# Altium schematic sheet MODULIQ_TDC.SchDoc: TDC
size A3; Author: M.Beldyga; CompanyName: WUT ISE; DrawnBy: M.Beldyga; Organization: WUT ISE; Address1: PW ISE; Address2: Nowowiejska 15/19 00-665 Warsaw; Address3: micbeldyga@gmail.com; SheetNumber: 1; SheetTotal: 2; ModifiedBy: -; CheckedDate: -; Title2: MODULIQ; DivGrp: WUT ISE; Designer: M.Beldyga; ModifiedDate: -; ProjectName: Sensor Box
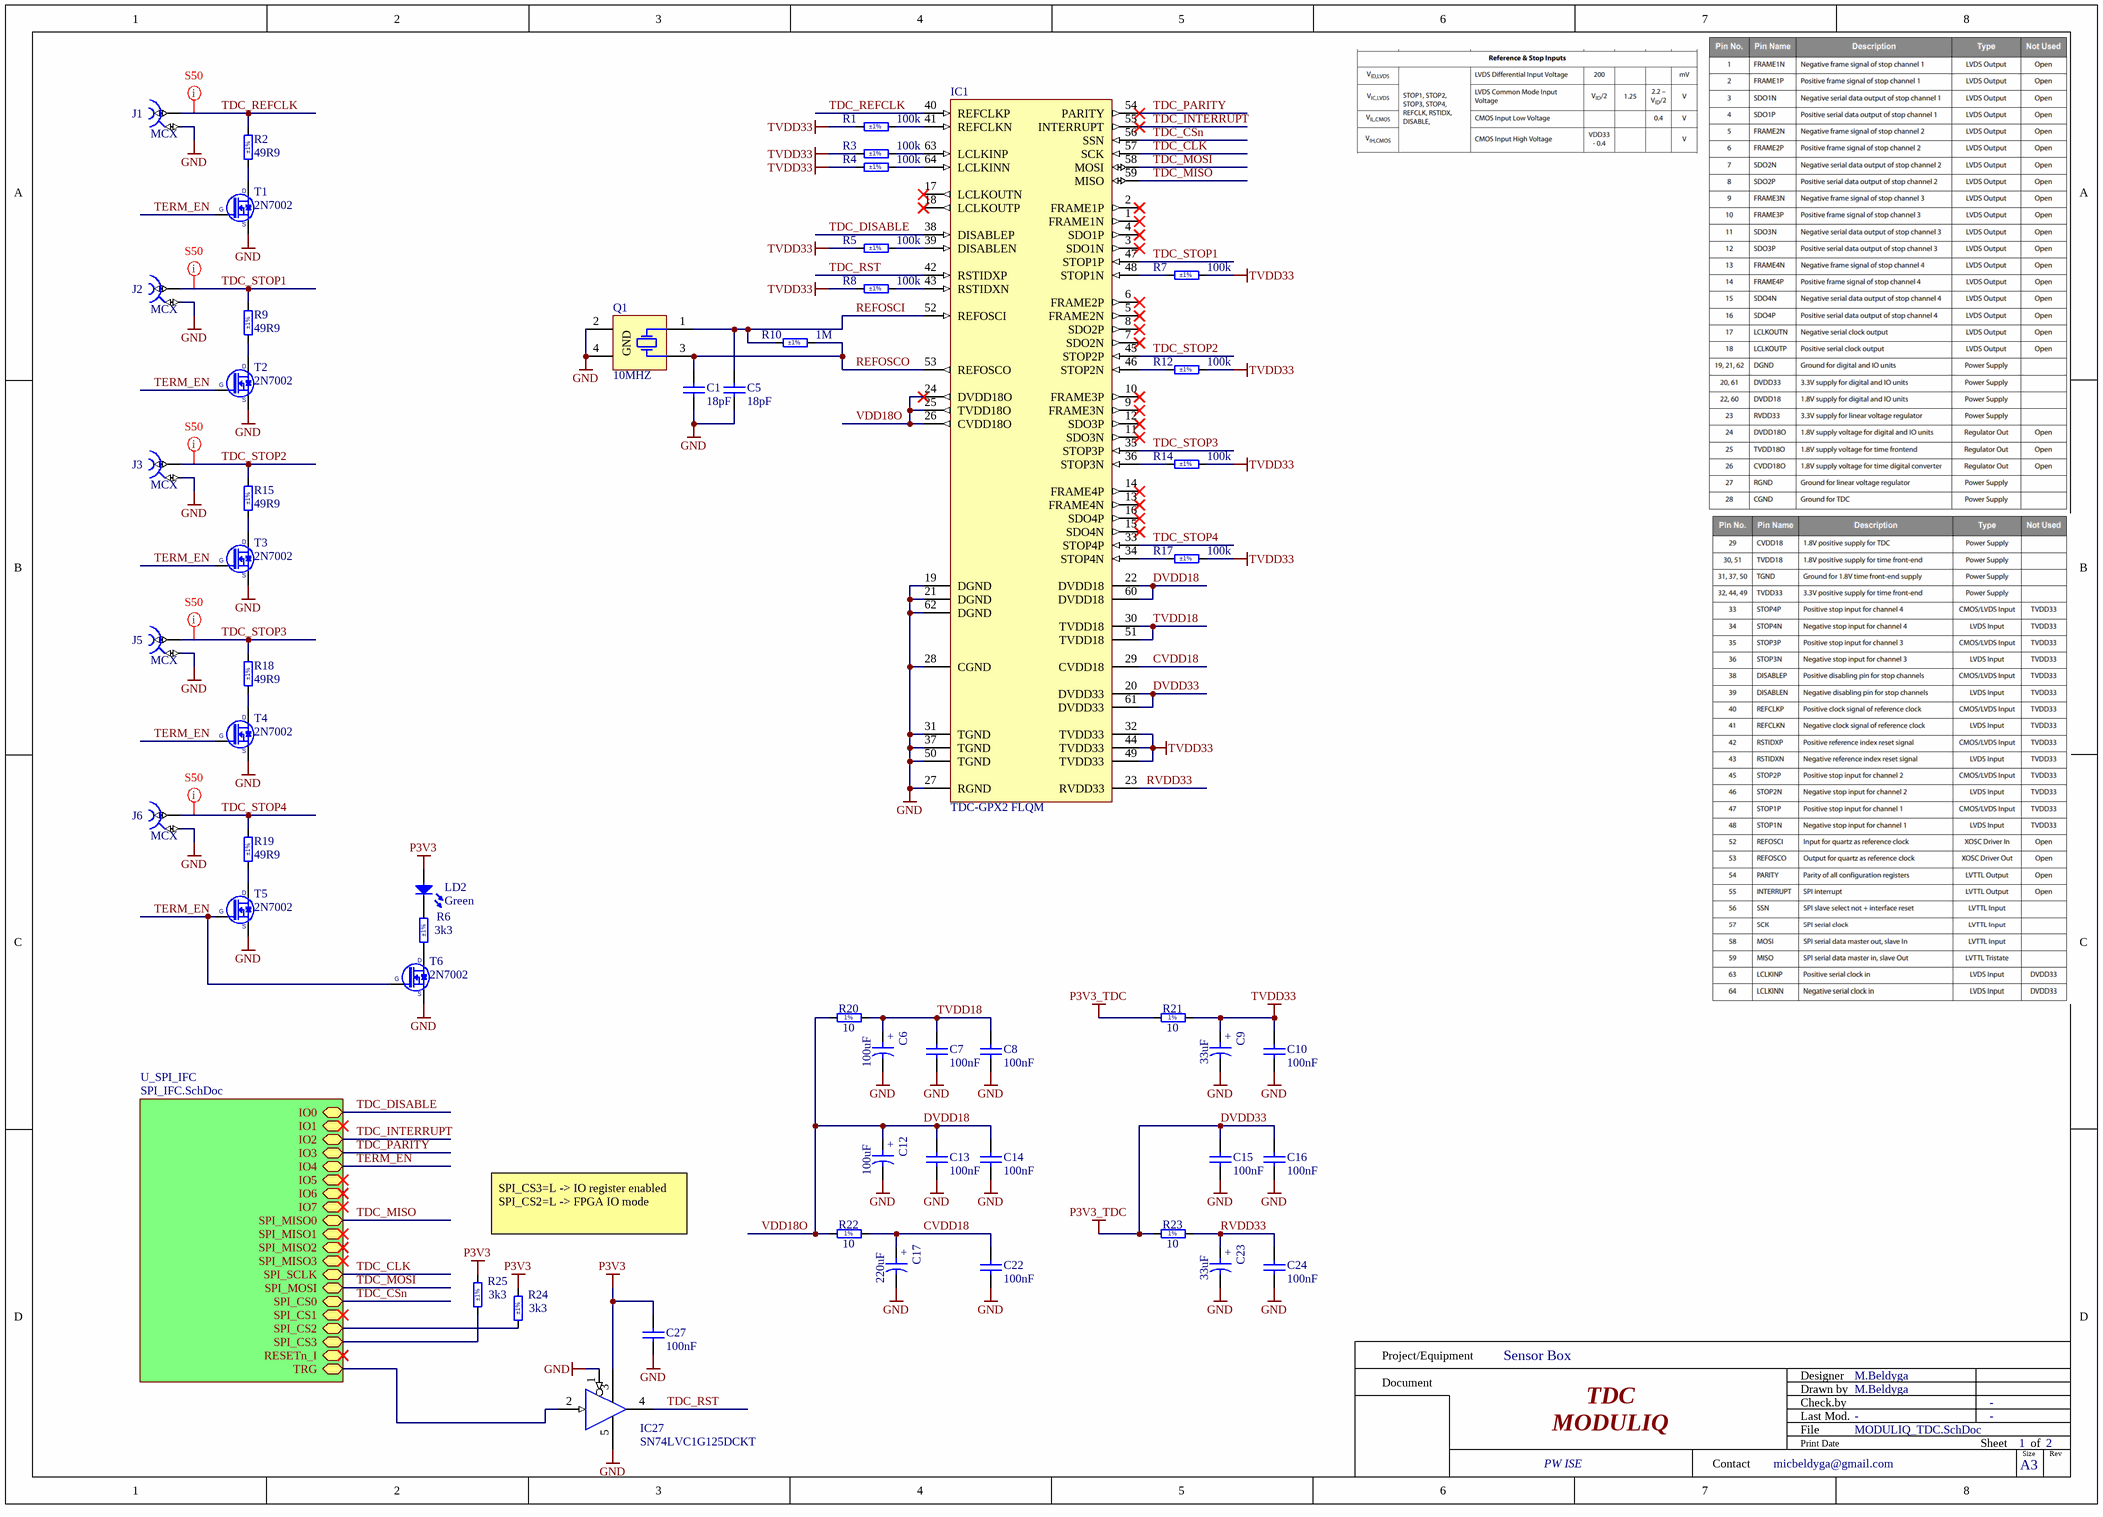
[diagram p0: MODULIQ_TDC.SchDoc]

## Parts
C1  18pF  [CAPC1005X55N]
C5  18pF  [CAPC1005X55N]
C6  100uF  [CAPMP3216X180N]
C7  100nF  [CAPC1005X55N]
C8  100nF  [CAPC1005X55N]
C9  33uF  [CAPMP3216X180N]
C10  100nF  [CAPC1005X55N]
C12  100uF  [CAPMP3216X180N]
C13  100nF  [CAPC1005X55N]
C14  100nF  [CAPC1005X55N]
C15  100nF  [CAPC1005X55N]
C16  100nF  [CAPC1005X55N]
C17  220uF  [CAPMP3528X210N]
C22  100nF  [CAPC1005X55N]
C23  33uF  [CAPMP3216X180N]
C24  100nF  [CAPC1005X55N]
C27  100nF  [CAPC1005X55N]
IC1  TDC-GPX2 FLQM  [QFP50P1200X1200X160-64N]
IC27  SN74LVC1G125DCKT  [SOT65P210X110-5N]
J1  MCX  [AMPHENOL_919-109J-51PX]
J2  MCX  [AMPHENOL_919-109J-51PX]
J3  MCX  [AMPHENOL_919-109J-51PX]
J5  MCX  [AMPHENOL_919-109J-51PX]
J6  MCX  [AMPHENOL_919-109J-51PX]
LD2  Green  [LED_KINGBRIGHT_KP-1608CGCK]
Q1  10MHZ  [XTAL_ABRACON_ABMM2]
R1  100k  Tolerance: ±1%  [RESC1005X40N]
R2  49R9  Tolerance: ±1%  [RESC3225X70N]
R3  100k  Tolerance: ±1%  [RESC1005X40N]
R4  100k  Tolerance: ±1%  [RESC1005X40N]
R5  100k  Tolerance: ±1%  [RESC1005X40N]
R6  3k3  Tolerance: ±1%  [RESC1005X40N]
R7  100k  Tolerance: ±1%  [RESC1005X40N]
R8  100k  Tolerance: ±1%  [RESC1005X40N]
R9  49R9  Tolerance: ±1%  [RESC3225X70N]
R10  1M  Tolerance: ±1%  [RESC1005X40N]
R12  100k  Tolerance: ±1%  [RESC1005X40N]
R14  100k  Tolerance: ±1%  [RESC1005X40N]
R15  49R9  Tolerance: ±1%  [RESC3225X70N]
R17  100k  Tolerance: ±1%  [RESC1005X40N]
R18  49R9  Tolerance: ±1%  [RESC3225X70N]
R19  49R9  Tolerance: ±1%  [RESC3225X70N]
R20  10  [RESC1005X40N]
R21  10  [RESC1005X40N]
R22  10  [RESC1005X40N]
R23  10  [RESC1005X40N]
R24  3k3  Tolerance: ±1%  [RESC1005X40N]
R25  3k3  Tolerance: ±1%  [RESC1005X40N]
T1  2N7002  [SOT95P240X130-3N]
T2  2N7002  [SOT95P240X130-3N]
T3  2N7002  [SOT95P240X130-3N]
T4  2N7002  [SOT95P240X130-3N]
T5  2N7002  [SOT95P240X130-3N]
T6  2N7002  [SOT95P240X130-3N]

## Sub-sheets
U_SPI_IFC = SPI_IFC.SchDoc: IO0 (bidir), IO1 (bidir), IO2 (bidir), IO3 (bidir), IO4 (bidir), IO5 (bidir), IO6 (bidir), IO7 (bidir), SPI_MISO0 (bidir), SPI_MISO1 (bidir), SPI_MISO2 (bidir), SPI_MISO3 (bidir), SPI_SCLK (bidir), SPI_MOSI (bidir), SPI_CS0 (bidir), SPI_CS1 (bidir), SPI_CS2 (bidir), SPI_CS3 (bidir), RESETn_I (bidir), TRG (bidir)

## Nets
DVDD33: C15.2 C16.2 IC1.20(DVDD33) IC1.61(DVDD33) R21.1 R23.1  [also labelled P3V3_TDC]
GND: C1.1 C5.1 C6.2 C7.1 C8.1 C9.2 C10.1 C12.2 C13.1 C14.1 C15.1 C16.1 C17.2 C22.1 C23.2 C24.1 C27.1 IC1.19(DGND) IC1.21(DGND) IC1.27(RGND) IC1.28(CGND) IC1.31(TGND) IC1.37(TGND) IC1.50(TGND) IC1.62(DGND) IC27.1(~{G}) IC27.5(VCC) J1.2 J2.2 J3.2 J5.2 J6.2 Q1.2(GND) Q1.4(GND) T1.2(S) T2.2(S) T3.2(S) T4.2(S) T5.2(S) T6.2(S)
P3V3: C27.2 IC27.3(GND) LD2.2(A) R24.1 R25.1
TVDD33: C9.1 C10.2 IC1.32(TVDD33) IC1.44(TVDD33) IC1.49(TVDD33) R1.2 R3.2 R4.2 R5.2 R7.2 R8.2 R12.2 R14.2 R17.2 R21.2
CVDD18: C17.1 C22.2 IC1.29(CVDD18) R22.2
DVDD18: C12.1 C13.2 C14.2 IC1.22(DVDD18) IC1.24(DVDD18O) IC1.25(TVDD18O) IC1.26(CVDD18O) IC1.60(DVDD18) R20.1 R22.1  [also labelled VDD18O]
REFOSCI: C5.2 IC1.52(REFOSCI) Q1.1(X) R10.2
REFOSCO: C1.2 IC1.53(REFOSCO) Q1.3(X) R10.1
RVDD33: C23.1 C24.2 IC1.23(RVDD33) R23.2
TDC_CLK: IC1.57(SCK) ; sheet U_SPI_IFC/SPI_SCLK
TDC_CSn: IC1.56(SSN) ; sheet U_SPI_IFC/SPI_CS0
TDC_DISABLE: IC1.38(DISABLEP) ; sheet U_SPI_IFC/IO0
TDC_INTERRUPT: IC1.55(INTERRUPT) ; sheet U_SPI_IFC/IO2
TDC_MISO: IC1.59(MISO) ; sheet U_SPI_IFC/SPI_MISO0
TDC_MOSI: IC1.58(MOSI) ; sheet U_SPI_IFC/SPI_MOSI
TDC_PARITY: IC1.54(PARITY) ; sheet U_SPI_IFC/IO3
TDC_REFCLK: IC1.40(REFCLKP) J1.1 R2.2
TDC_RST: IC1.42(RSTIDXP) IC27.4(OUT)
TDC_STOP1: IC1.47(STOP1P) J2.1 R9.2
TDC_STOP2: IC1.45(STOP2P) J3.1 R15.2
TDC_STOP3: IC1.35(STOP3P) J5.1 R18.2
TDC_STOP4: IC1.33(STOP4P) J6.1 R19.2
TERM_EN: T1.1(G) T2.1(G) T3.1(G) T4.1(G) T5.1(G) T6.1(G) ; sheet U_SPI_IFC/IO4
TVDD18: C6.1 C7.2 C8.2 IC1.30(TVDD18) IC1.51(TVDD18) R20.2
NetIC1_34: IC1.34(STOP4N) R17.1
NetIC1_36: IC1.36(STOP3N) R14.1
NetIC1_39: IC1.39(DISABLEN) R5.1
NetIC1_41: IC1.41(REFCLKN) R1.1
NetIC1_43: IC1.43(RSTIDXN) R8.1
NetIC1_46: IC1.46(STOP2N) R12.1
NetIC1_48: IC1.48(STOP1N) R7.1
NetIC1_63: IC1.63(LCLKINP) R3.1
NetIC1_64: IC1.64(LCLKINN) R4.1
NetIC27_2: IC27.2(IN) ; sheet U_SPI_IFC/TRG
NetLD2_1: LD2.1(C) R6.1
NetR2_1: R2.1 T1.3(D)
NetR6_2: R6.2 T6.3(D)
NetR9_1: R9.1 T2.3(D)
NetR15_1: R15.1 T3.3(D)
NetR18_1: R18.1 T4.3(D)
NetR19_1: R19.1 T5.3(D)
NetR24_2: R24.2 ; sheet U_SPI_IFC/SPI_CS2
NetR25_2: R25.2 ; sheet U_SPI_IFC/SPI_CS3

Not connected (* = marked no-connect by the designer): IC1 1(FRAME1N)* 2(FRAME1P)* 3(SDO1N)* 4(SDO1P)* 5(FRAME2N)* 6(FRAME2P)* 7(SDO2N)* 8(SDO2P)* 9(FRAME3N)* 10(FRAME3P)* 11(SDO3N)* 12(SDO3P)* 13(FRAME4N)* 14(FRAME4P)* 15(SDO4N)* 16(SDO4P)* 17(LCLKOUTN)* 18(LCLKOUTP)*

## Layout directives
net class S50: TDC_REFCLK
net class S50; net class TDC_IN: TDC_STOP1, TDC_STOP2, TDC_STOP3, TDC_STOP4

## Notes on the sheet
- SPI_CS3=L -> IO register enabled
  SPI_CS2=L -> FPGA IO mode
- Project/Equipment
- Document
- Designer
- Drawn by
- Check.by
- Contact
- File
- Last Mod.
- Print Date
- Sheet
- Size
- A3
- of
- Rev
- (in symbol CTE3216-18_33UF_4V_10%) +
- (in symbol CTE3216-18_100UF_6.3V_20%_ESR0500_AVX_TLJ) +
- (in symbol CTE3528-21_220UF_2.5V_10%) +
- (in symbol R0402_10R_1%_0.0625W_200PPM) 1%

## Library data of the parts
C1 C5 = CC0402_18PF_50V_5%_C0G: Non-polarised capacitor; Part Description: SMD Multilayer Chip Ceramic Capacitor; Manufacturer: GENERIC; Manufacturer1 Part Number: C0402C180J5GACTU; Voltage: 50V; TC: C0G/NP0; Tolerance: ±5%; Part Number: CC0402_18PF_50V_5%_C0G; Component Kind: Standard; Component Type: Standard; Pin Count: 2; Value: 18pF; Status: Preferred; Manufacturer Part Number: CC0402_18PF_50V_5%_C0G; Case: 0402; Mounted: Yes; Socket: No; SMD: Yes; Sense: No; Manufacturer1 Example: KEMET; Manufacturer1 ComponentHeight: 0.55mm; HelpURL: \\cern.ch\dfs\Applications\Altium\Datasheets\CC0402_C0G_KEMET_(Commercial Grade).pdf; Author: CERN DEM JLC; CreateDate: 10/4/2016; LatestRevisionDate: 10/4/2016
C6 C12 = CTE3216-18_100UF_6.3V_20%_ESR0500_AVX_TLJ: Polarised capacitor; Part Description: ESR 0R5 Solid Tantalum Chip Capacitor; Manufacturer: AVX; Manufacturer Part Number: TLJA107M006R0500; Voltage: 6.3V; Tolerance: ±20%; Part Number: CTE3216-18_100UF_6.3V_20%_ESR0500_AVX_TLJ; Component Kind: Standard; Component Type: Standard; Pin Count: 2; Value: 100uF; Status: None; Case: A; Mounted: Yes; Socket: No; SMD: Yes; Sense: No; ComponentHeight: 1.8mm; HelpURL: \\cern.ch\dfs\Applications\Altium\Datasheets\CTE_AVX_TLJ.pdf; Author: CERN DEM JLC; CreateDate: 19.12.2013; LatestRevisionDate: 19.12.2013
C7 C8 C10 C13-C16 C22 C24 C27 = CC0402_100NF_50V_10%_X7R: Non-polarised capacitor; Part Description: SMD Multilayer Chip Ceramic Capacitor; Manufacturer: GENERIC; Manufacturer1 Part Number: GRM155R71H104KE14D; Voltage: 50V; TC: X7R; Tolerance: ±10%; Part Number: CC0402_100NF_50V_10%_X7R; Component Kind: Standard; Component Type: Standard; Pin Count: 2; Value: 100nF; Status: None; Manufacturer Part Number: CC0402_100NF_50V_10%_X7R; Case: 0402; Mounted: Yes; Socket: No; SMD: Yes; Sense: No; Manufacturer1 Example: MURATA; Manufacturer1 ComponentHeight: 0.55mm; HelpURL: \\cern.ch\dfs\Applications\Altium\Datasheets\CC0402_MURATA_GRM155R71H104KE14D.pdf; Author: CERN DEM MR; CreateDate: 6/30/2017; LatestRevisionDate: 6/30/2017
C9 C23 = CTE3216-18_33UF_4V_10%: Polarised capacitor; Part Description: Solid Tantalum Chip Capacitor; Manufacturer: GENERIC; Manufacturer1 Part Number: TAJA336K004R; Voltage: 4V; Tolerance: ±10%; Part Number: CTE3216-18_33UF_4V_10%; Component Kind: Standard; Component Type: Standard; Pin Count: 2; Value: 33uF; Status: Preferred; Manufacturer Part Number: CTE3216-18_33UF_4V_10%; Case: A; Mounted: Yes; Socket: No; SMD: Yes; Sense: No; Manufacturer1 Example: AVX; Manufacturer1 ComponentHeight: 1.8mm; HelpURL: \\cern.ch\dfs\Applications\Altium\Datasheets\CTE_AVX_TAJ.pdf; Author: CERN DEM JLC; CreateDate: 03.12.2007; LatestRevisionDate: 03.12.2007
C17 = CTE3528-21_220UF_2.5V_10%: Polarised capacitor; Part Description: Solid Tantalum Chip Capacitor; Manufacturer: GENERIC; Manufacturer1 Part Number: TAJB227K002R; Voltage: 2.5V; Tolerance: ±10%; Part Number: CTE3528-21_220UF_2.5V_10%; Component Kind: Standard; Component Type: Standard; Pin Count: 2; Value: 220uF; Status: Preferred; Manufacturer Part Number: CTE3528-21_220UF_2.5V_10%; Case: B; Mounted: Yes; Socket: No; SMD: Yes; Sense: No; Manufacturer1 Example: AVX; Manufacturer1 ComponentHeight: 2.1mm; HelpURL: \\cern.ch\dfs\Applications\Altium\Datasheets\CTE_AVX_TAJ.pdf; Author: CERN DEM JLC; CreateDate: 03.12.2007; LatestRevisionDate: 03.12.2007
IC1 = TDC-GPX2: 4 Channel Time to Digital Converter; Manufacturer: AMS; PressFit: No; Bonding: No; Part Number: TDC-GPX2; Component Kind: Standard; Component Type: Standard; Device: TDC-GPX2 FLQM; PackageDescription: QFP, 0.50mm Pitch, Square; 64 Pin, 10.0mm L X 10.0mm W X 1.60mm H Body, IPC Medium Density; Part Description: 4 Channel Time to Digital Converter; Manufacturer Part Number: TDC-GPX2 FLQM; Pin Count: 64; Case: QFP64; Mounted: Yes; Socket: No; SMD: Yes; Sense: No; ComponentHeight: 1.6mm; Author: CERN DEM MR; HelpURL: \\cern.ch\dfs\Applications\Altium\Datasheets\AMS_TDC-GPX2.pdf; CreateDate: 4/23/2019; LatestRevisionDate: 4/5/2024
IC27 = SN74LVC1G125DCKT: Single Bus Buffer Gate With 3-State Output; Part Description: Single Bus Buffer Gate With 3-State Outputs; Manufacturer: TEXAS INSTRUMENTS; PressFit: No; Bonding: No; Part Number: SN74LVC1G125DCKT; Component Kind: Standard; Component Type: Standard; Device: SN74LVC1G125DCKT; PackageDescription: SOT353, SC70-5, SOT, 0.65mm Pitch, 5 pin, 1.25mm W X 2.00mm L X 1.10mm H, IPC Medium Density; Manufacturer Part Number: SN74LVC1G125DCKT; Pin Count: 5; Case: SOT353; Mounted: Yes; Socket: No; SMD: Yes; Sense: No; ComponentHeight: 1.1mm; Author: CERN DEM JLC; HelpURL: \\cern.ch\dfs\Applications\Altium\Datasheets\SN74LVC1G125DCKT.pdf; CreateDate: 12/19/2011; LatestRevisionDate: 12/19/2011
J1-J3 J5 J6 = AMPHENOL_919-109J-51PX: Part Description: 50 Ohms, RF Connector, MCX Straight PCB Receptacle Jack; Manufacturer Part Number: 919-109J-51PX (MCX6251B1-3GT30G-50); PressFit: No; Part Number: AMPHENOL_919-109J-51PX; Component Kind: Standard; Component Type: Standard; Pin Count: 5; Family: MCX; Mounted: Yes; Socket: No; SMD: No; Sense: No; Status: None; Manufacturer: AMPHENOL; ComponentHeight: 6.06mm; HelpURL: \\cern.ch\dfs\Applications\Altium\Datasheets\AMPHENOL_919-109J-51PX.pdf; Author: CERN DEM BC; CreateDate: 31.01.2019; LatestRevisionDate: 31.01.2019
LD2 = LED_KINGBRIGHT_KP-1608CGCK: LED Green 1C 2A; Part Description: 1.6x0.8mm SMD Chip Green LED Lamp; PressFit: No; Bonding: No; Part Number: LED_KINGBRIGHT_KP-1608CGCK; Component Kind: Standard; Component Type: Standard; Color: Green; PackageDescription: SMT Green LED, Case 0603, Body L 1.60mm x W 0.80mm x H 1.10mm; Manufacturer: KINGBRIGHT; Manufacturer Part Number: KP-1608CGCK; Pin Count: 2; Case: 0603; Mounted: Yes; Socket: No; SMD: Yes; Sense: No; ComponentHeight: 1.1mm; HelpURL: \\cern.ch\dfs\Applications\Altium\Datasheets\LED_KINGBRIGHT_KP-1608CGCK.pdf; Author: CERN DEM HF; CreateDate: 10/1/2021; LatestRevisionDate: 10/1/2021
Q1 = XTAL_10MHZ_ABRACON_ABMM2-10.000MHZ-E2-T: Crystal 4 pins 1=XTAL Control 2=GND3=XTAL 4=GND; Part Description: Tolerance: ±20ppm, -20°C to +70°C, 18pF, SMD Crystal, ABMM2 Series; PressFit: No; Bonding: No; Part Number: XTAL_10MHZ_ABRACON_ABMM2-10.000MHZ-E2-T; Component Kind: Standard; Component Type: Standard; PackageDescription: 4 Pins,  6mm L X 3.5mm H, SMD Low Profile Crystal, ABMM2 Serie; Value: 10MHZ; Manufacturer: ABRACON; Manufacturer Part Number: ABMM2-10.000MHZ-E2-T; Pin Count: 4; Mounted: Yes; Socket: No; SMD: Yes; Sense: No; ComponentHeight: 1.2mm; HelpURL: \\cern.ch\dfs\Applications\Altium\Datasheets\XTAL_ABRACON_ABMM2.pdf; Author: CERN DEM MR; CreateDate: 12/10/2015; LatestRevisionDate: 12/10/2015
R1 R3-R5 R7 R8 R12 R14 R17 = R0402_100K_1%_0.0625W_100PPM: Resistor - 1%; Part Description: General Purpose Thick Film Chip Resistor; Manufacturer: GENERIC; Manufacturer1 Part Number: 232270671004L; TC: ±100ppm/°C; PressFit: No; Part Number: R0402_100K_1%_0.0625W_100PPM; Component Kind: Standard; Component Type: Standard; Pin Count: 2; Value: 100k; Status: Not Recommended; Power: 0.0625W; Manufacturer Part Number: R0402_100K_1%_0.0625W_100PPM; Case: 0402; Mounted: Yes; Sense: No; Socket: No; SMD: Yes; Manufacturer1 Example: YAGEO PHYCOMP; Manufacturer1 ComponentHeight: 0.4mm; HelpURL: \\cern.ch\dfs\Applications\Altium\Datasheets\R0402_Phycomp_RC0402.pdf; Author: CERN DEM JLC; CreateDate: 12/3/2007; LatestRevisionDate: 10/17/2012
R2 R9 R15 R18 R19 = R1210_49R9_1%_0.5W_100PPM_VISHAY_CRCW: Resistor - 1%; Part Description: Thick Film Chip Resistor; Manufacturer: VISHAY DRALORIC; Manufacturer Part Number: CRCW121049R9FK; Power: 0.5W; TC: ±100ppm/°C; PressFit: No; Part Number: R1210_49R9_1%_0.5W_100PPM_VISHAY_CRCW; Component Kind: Standard; Component Type: Standard; Pin Count: 2; Value: 49R9; Status: None; Case: 1210; Mounted: Yes; Sense: No; Socket: No; SMD: Yes; ComponentHeight: 0.7mm; HelpURL: \\cern.ch\dfs\Applications\Altium\Datasheets\R1210_VISHAY_CRCW1210.pdf; Author: CERN DEM JMW; CreateDate: 8/6/2014; LatestRevisionDate: 8/6/2014
R6 R24 R25 = R0402_3K3_1%_0.0625W_100PPM: Resistor - 1%; Part Description: General Purpose Thick Film Chip Resistor; Manufacturer: GENERIC; Manufacturer1 Part Number: 232270673302L; TC: ±100ppm/°C; PressFit: No; Part Number: R0402_3K3_1%_0.0625W_100PPM; Component Kind: Standard; Component Type: Standard; Pin Count: 2; Value: 3k3; Status: Not Recommended; Power: 0.0625W; Manufacturer Part Number: R0402_3K3_1%_0.0625W_100PPM; Case: 0402; Mounted: Yes; Sense: No; Socket: No; SMD: Yes; Manufacturer1 Example: YAGEO PHYCOMP; Manufacturer1 ComponentHeight: 0.4mm; HelpURL: \\cern.ch\dfs\Applications\Altium\Datasheets\R0402_Phycomp_RC0402.pdf; Author: CERN DEM JLC; CreateDate: 03.12.2007; LatestRevisionDate: 17.10.2012
R10 = R0402_1M_1%_0.0625W_100PPM: Resistor - 1%; Part Description: General Purpose Thick Film Chip Resistor; Manufacturer: GENERIC; Manufacturer1 Part Number: 232270671005L; TC: ±100ppm/°C; PressFit: No; Part Number: R0402_1M_1%_0.0625W_100PPM; Component Kind: Standard; Component Type: Standard; Pin Count: 2; Value: 1M; Status: Not Recommended; Power: 0.0625W; Manufacturer Part Number: R0402_1M_1%_0.0625W_100PPM; Case: 0402; Mounted: Yes; Sense: No; Socket: No; SMD: Yes; Manufacturer1 Example: YAGEO PHYCOMP; Manufacturer1 ComponentHeight: 0.4mm; HelpURL: \\cern.ch\dfs\Applications\Altium\Datasheets\R0402_Phycomp_RC0402.pdf; Author: CERN DEM JLC; CreateDate: 12/3/2007; LatestRevisionDate: 10/17/2012
R20-R23 = R0402_10R_1%_0.0625W_200PPM: Resistor - 1%; Part Description: General Purpose Thick Film Chip Resistor; Manufacturer: GENERIC; Manufacturer1 Part Number: 232270671009L; TC: ±200ppm/°C; PressFit: No; Part Number: R0402_10R_1%_0.0625W_200PPM; Component Kind: Standard; Component Type: Standard; Pin Count: 2; Value: 10; Status: Not Recommended; Power: 0.0625W; Tolerance: ±1%; Manufacturer Part Number: R0402_10R_1%_0.0625W_200PPM; Case: 0402; Mounted: Yes; Sense: No; Socket: No; SMD: Yes; Manufacturer1 Example: YAGEO PHYCOMP; Manufacturer1 ComponentHeight: 0.4mm; HelpURL: \\cern.ch\dfs\Applications\Altium\Datasheets\R0402_Phycomp_RC0402.pdf; Author: CERN DEM JLC; CreateDate: 24.06.2009; LatestRevisionDate: 17.10.2012
T1-T6 = 2N7002: N-CHANNEL MOSFET WITH DIODE; Part Description: 60V, 280mA, N-Channel Enhancement Mode Field Effect Transistor (FET); Manufacturer: FAIRCHILD SEMICONDUCTOR; PressFit: No; Bonding: No; Part Number: 2N7002; Component Kind: Standard; Component Type: Standard; Device: 2N7002; PackageDescription: SOT23, 0.95mm Pitch; 3 Pin, 1.30mm W X 2.90mm L X 1.30mm H body, IPC Medium Density; Manufacturer Part Number: 2N7002; Pin Count: 3; Case: SOT23-3; Mounted: Yes; Socket: No; SMD: Yes; Sense: No; ComponentHeight: 1.3mm; HelpURL: \\cern.ch\dfs\Applications\Altium\Datasheets\2N7002.pdf; Author: CERN DEM JLC; CreateDate: 8/20/2008; LatestRevisionDate: 4/7/2009